# Altium schematic sheet Sheet1.SchDoc
size A; SheetNumber: 1; SheetTotal: 1
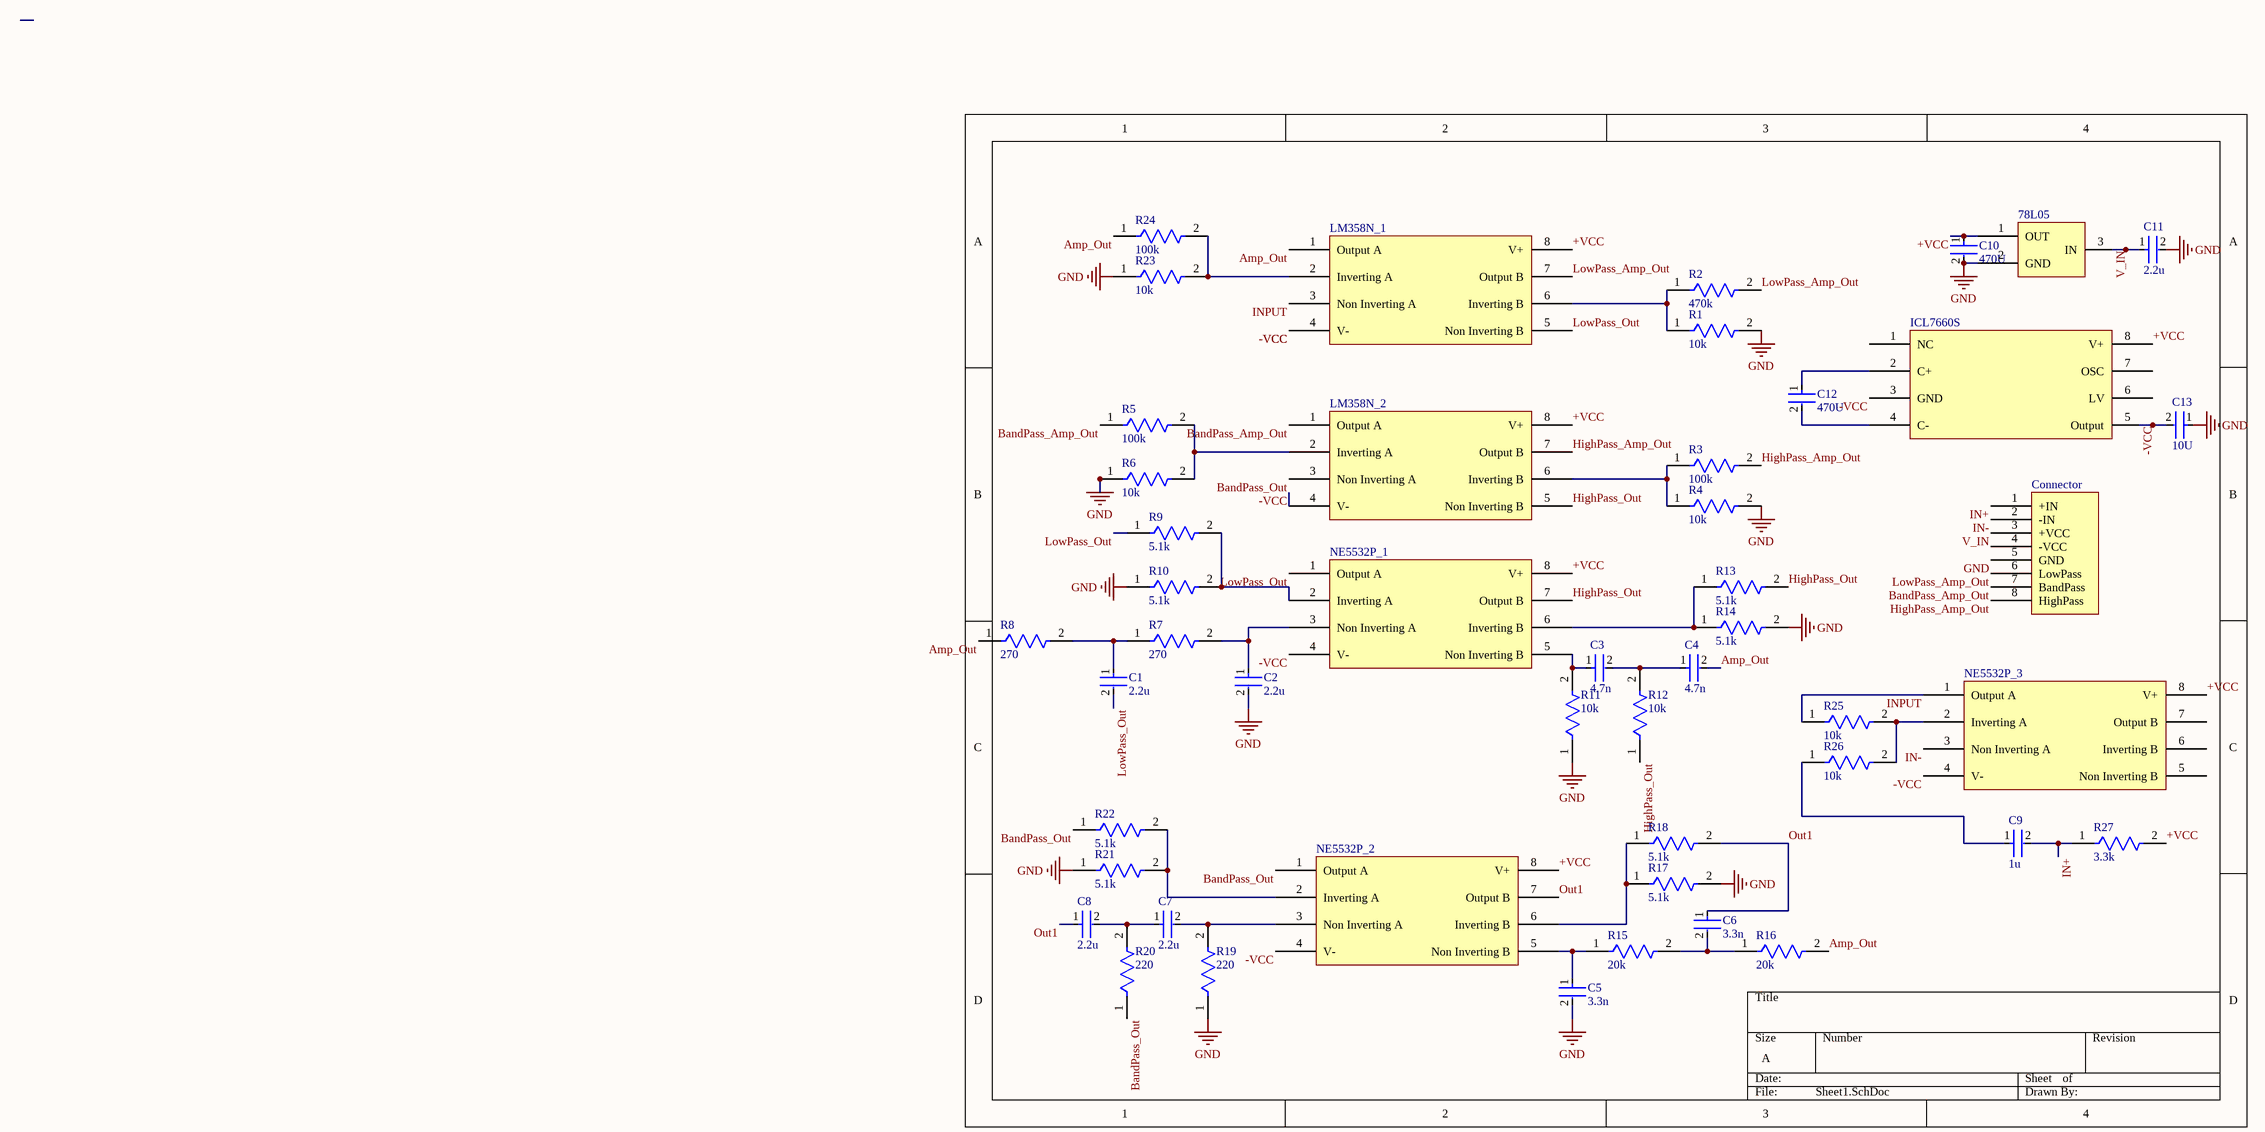
[diagram p0: Sheet1.SchDoc]

## Parts
78L05  (no value)  [78L05]
C1  2.2u  [2.2u]
C2  2.2u  [2.2u]
C3  4.7n  [4.7n]
C4  4.7n  [4.7n]
C5  3.3n  [4.7n]
C6  3.3n  [4.7n]
C7  2.2u  [2.2u]
C8  2.2u  [2.2u]
C9  1u  [1u]
C10  470U  [470u]
C11  2.2u  [2.2u]
C12  470U  [470u]
C13  10U  [10u]
Connector  (no value)  [Connector]
ICL7660S  (no value)  [ICL7660S]
LM358N_1  (no value)  [LM358N]
LM358N_2  (no value)  [LM358N]
NE5532P_1  (no value)  [NE5532P]
NE5532P_2  (no value)  [NE5532P]
NE5532P_3  (no value)  [NE5532P]
R1  10k  [THT]
R2  470k  [THT]
R3  100k  [THT]
R4  10k  [THT]
R5  100k  [THT]
R6  10k  [THT]
R7  270  [THT]
R8  270  [THT]
R9  5.1k  [THT]
R10  5.1k  [THT]
R11  10k  [THT]
R12  10k  [THT]
R13  5.1k  [THT]
R14  5.1k  [THT]
R15  20k  [THT]
R16  20k  [THT]
R17  5.1k  [THT]
R18  5.1k  [THT]
R19  220  [THT]
R20  220  [THT]
R21  5.1k  [THT]
R22  5.1k  [THT]
R23  10k  [THT]
R24  100k  [THT]
R25  10k  [THT]
R26  10k  [THT]
R27  3.3k  [THT]

## Nets
GND: 78L05.2(GND) C2.2 C5.2 C10.2 C11.2 C13.1 Connector.5(GND) R1.2 R4.2 R6.1 R10.1 R11.1 R14.2 R17.2 R19.1 R21.1 R23.1
+VCC: 78L05.1(OUT) C10.1 ICL7660S.8(V+) LM358N_1.8(V+) LM358N_2.8(V+) NE5532P_1.8(V+) NE5532P_2.8(V+) NE5532P_3.8(V+) R27.2
-VCC: C13.2 ICL7660S.3(GND) ICL7660S.5(Output) LM358N_1.4(V-) LM358N_2.4(V-) NE5532P_1.4(V-) NE5532P_2.4(V-) NE5532P_3.4(V-)
Amp_Out: C4.2 LM358N_1.1(Output_A) R8.1 R16.2 R24.1
BandPass_Amp_Out: Connector.7(BandPass) LM358N_2.1(Output_A) R5.1
BandPass_Out: LM358N_2.3(Non_Inverting_A) NE5532P_2.1(Output_A) R20.1 R22.1
HighPass_Amp_Out: Connector.8(HighPass) LM358N_2.7(Output_B) R3.2
HighPass_Out: LM358N_2.5(Non_Inverting_B) NE5532P_1.7(Output_B) R12.1 R13.2
IN+: C9.2 Connector.1(+IN) R27.1
IN-: Connector.2(-IN) NE5532P_3.3(Non_Inverting_A)
INPUT: LM358N_1.3(Non_Inverting_A) NE5532P_3.1(Output_A) R25.1
LowPass_Amp_Out: Connector.6(LowPass) LM358N_1.7(Output_B) R2.2
LowPass_Out: C1.2 LM358N_1.5(Non_Inverting_B) NE5532P_1.1(Output_A) R9.1
Out1: C6.1 C8.1 NE5532P_2.7(Output_B) R18.2
V_IN: 78L05.3(IN) C11.1 Connector.3(+VCC)
NetC1_1: C1.1 R7.1 R8.2
NetC2_1: C2.1 NE5532P_1.3(Non_Inverting_A) R7.2
NetC3_1: C3.1 NE5532P_1.5(Non_Inverting_B) R11.2
NetC3_2: C3.2 C4.1 R12.2
NetC5_1: C5.1 NE5532P_2.5(Non_Inverting_B) R15.1
NetC6_2: C6.2 R15.2 R16.1
NetC7_1: C7.1 C8.2 R20.2
NetC7_2: C7.2 NE5532P_2.3(Non_Inverting_A) R19.2
NetC9_1: C9.1 R26.1
NetC12_1: C12.1 ICL7660S.2(C+)
NetC12_2: C12.2 ICL7660S.4(C-)
NetLM358N_1_2: LM358N_1.2(Inverting_A) R23.2 R24.2
NetLM358N_1_6: LM358N_1.6(Inverting_B) R1.1 R2.1
NetLM358N_2_2: LM358N_2.2(Inverting_A) R5.2 R6.2
NetLM358N_2_6: LM358N_2.6(Inverting_B) R3.1 R4.1
NetNE5532P_1_2: NE5532P_1.2(Inverting_A) R9.2 R10.2
NetNE5532P_1_6: NE5532P_1.6(Inverting_B) R13.1 R14.1
NetNE5532P_2_2: NE5532P_2.2(Inverting_A) R21.2 R22.2
NetNE5532P_2_6: NE5532P_2.6(Inverting_B) R17.1 R18.1
NetNE5532P_3_2: NE5532P_3.2(Inverting_A) R25.2 R26.2

Not connected (* = marked no-connect by the designer): Connector 4(-VCC); ICL7660S 1(NC) 6(LV) 7(OSC); NE5532P_3 5(Non_Inverting_B) 6(Inverting_B) 7(Output_B)

## Library data of the parts
78L05 = 78L05
Connector = Connector
ICL7660S = ICL7660S
LM358N_1 LM358N_2 = LM358N
NE5532P_1-NE5532P_3 = NE5532P